# Altium schematic sheet PIC.SchDoc: Rainbow Clock Project
size A4; DrawnBy: vchesnea; Organization: In alphabetical order:; Address2: - schiad; Address3: - vchesnea; Revision: A
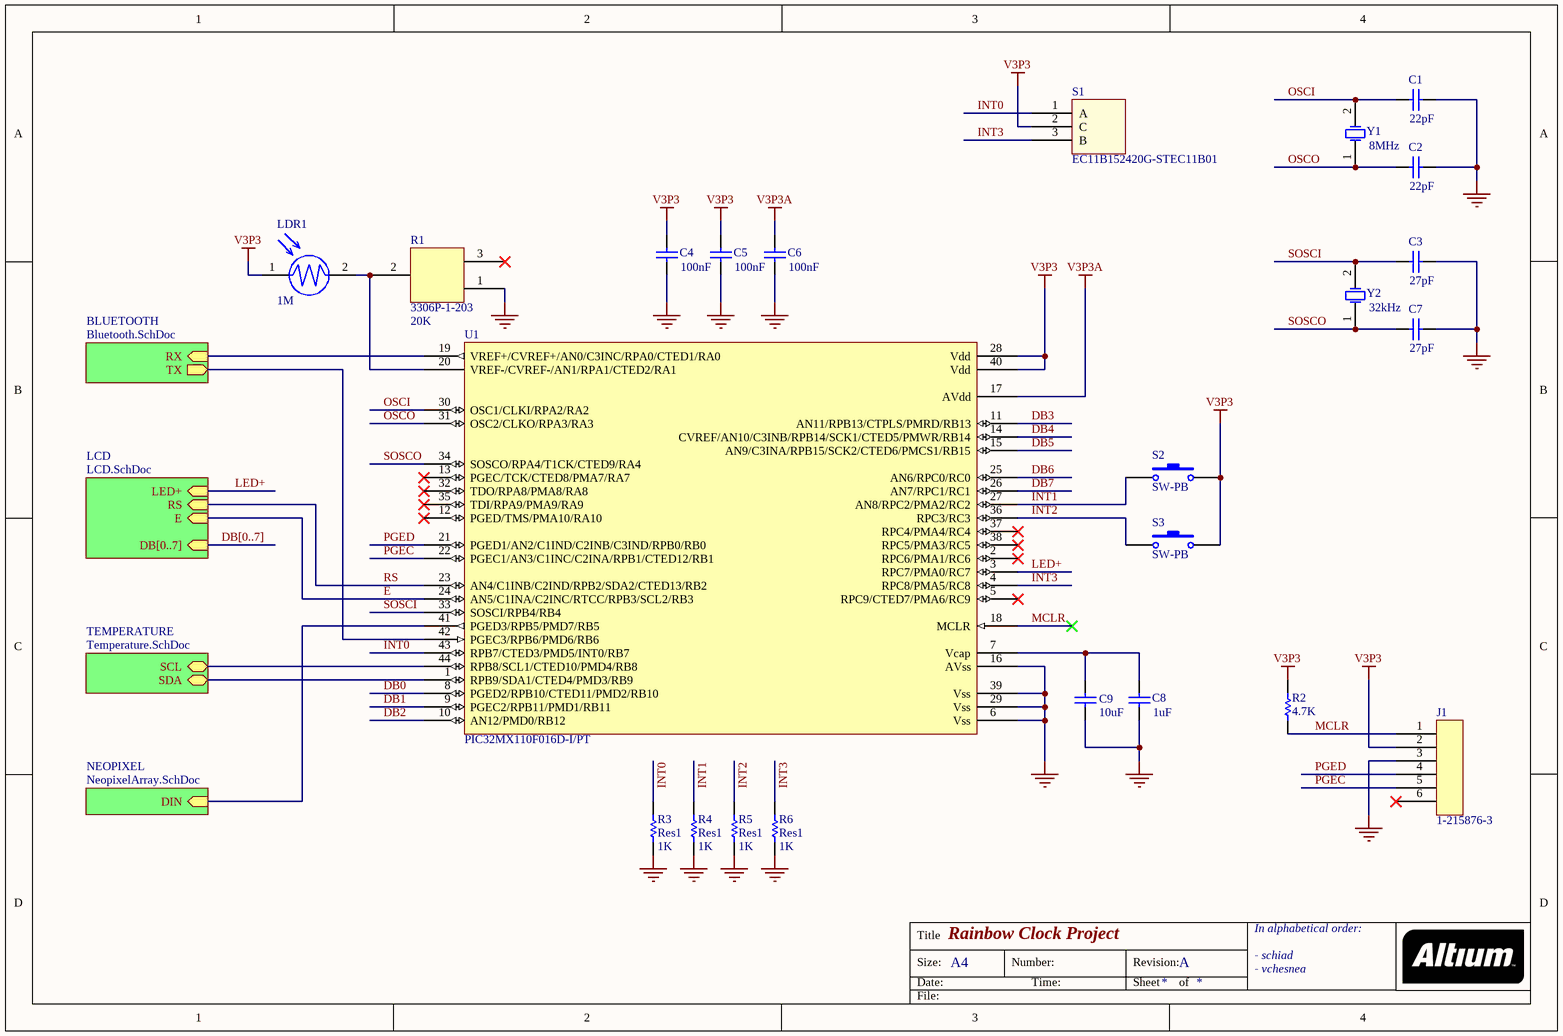
[diagram p0: PIC.SchDoc]

## Parts
C1  value 22pF  [RAD-0.3]  (hidden comment: Cap)
C2  value 22pF  [RAD-0.3]  (hidden comment: Cap)
C3  value 27pF  [RAD-0.3]  (hidden comment: Cap)
C4  value 100nF  [RAD-0.3]  (hidden comment: Cap)
C5  value 100nF  [RAD-0.3]  (hidden comment: Cap)
C6  value 100nF  [RAD-0.3]  (hidden comment: Cap)
C7  value 27pF  [RAD-0.3]  (hidden comment: Cap)
C8  value 1uF  [RAD-0.3]  (hidden comment: Cap)
C9  value 10uF  [RAD-0.3]  (hidden comment: Cap)
J1  1-215876-3
LDR1  value 1M  (hidden comment: LDR)
R1  3306P-1-203  value 20K  [3306P-1-202]
R2  value 4.7K  [AXIAL-0.3]  (hidden comment: Res1)
R3  Res1  value 1K  [AXIAL-0.3]
R4  Res1  value 1K  [AXIAL-0.3]
R5  Res1  value 1K  [AXIAL-0.3]
R6  Res1  value 1K  [AXIAL-0.3]
S1  EC11B152420G-STEC11B01  [EC11B152420G-STEC11B01]
S2  SW-PB  [Button]
S3  SW-PB  [SPST-2]
U1  PIC32MX110F016D-I/PT
Y1  value 8MHz  [R38]  (hidden comment: XTAL)
Y2  value 32kHz  [R38]  (hidden comment: XTAL)

## Sub-sheets
BLUETOOTH = Bluetooth.SchDoc: RX (in), TX (out)
LCD = LCD.SchDoc: RS (in), E (in), LED+ (in), DB[0..7] (in)
NEOPIXEL = NeopixelArray.SchDoc: DIN (in)
TEMPERATURE = Temperature.SchDoc: SDA (bidir), SCL (bidir)

## Nets
GND: C1.2 C2.2 C3.2 C4.1 C5.1 C6.1 C7.2 J1.3 R1.1 R3.2 R4.1 R5.1 R6.1
V3P3: C4.2 C5.2 J1.2 LDR1.1 R2.2 S1.2(C) S2.2 S3.2 U1.28(Vdd) U1.40(Vdd)
V3P3A: C6.2 U1.17(AVdd)
VSS: C8.1 C9.1 U1.6(Vss) U1.16(AVss) U1.29(Vss) U1.39(Vss)
DB0: U1.8(PGED2/RPB10/CTED11/PMD2/RB10)
DB1: U1.9(PGEC2/RPB11/PMD1/RB11)
DB2: U1.10(AN12/PMD0/RB12)
DB3: U1.11(AN11/RPB13/CTPLS/PMRD/RB13)
DB4: U1.14(CVREF/AN10/C3INB/RPB14/SCK1/CTED5/PMWR/RB14)
DB5: U1.15(AN9/C3INA/RPB15/SCK2/CTED6/PMCS1/RB15)
DB6: U1.25(AN6/RPC0/RC0)
DB7: U1.26(AN7/RPC1/RC1)
E: U1.24(AN5/C1INA/C2INC/RTCC/RPB3/SCL2/RB3) ; sheet LCD/E
INT0: R3.1 S1.1(A) U1.43(RPB7/CTED3/PMD5/INT0/RB7)
INT1: R4.2 S2.1 U1.27(AN8/RPC2/PMA2/RC2)
INT2: R5.2 S3.1 U1.36(RPC3/RC3)
INT3: R6.2 S1.3(B) U1.4(RPC8/PMA5/RC8)
LED+: U1.3(RPC7/PMA0/RC7) ; sheet LCD/LED+
MCLR: J1.1 R2.1 U1.18(MCLR)
OSCI: C1.1 U1.30(OSC1/CLKI/RPA2/RA2) Y1.2(OSC2)
OSCO: C2.1 U1.31(OSC2/CLKO/RPA3/RA3) Y1.1(OSC1)
PGEC: J1.5 U1.22(PGEC1/AN3/C1INC/C2INA/RPB1/CTED12/RB1)
PGED: J1.4 U1.21(PGED1/AN2/C1IND/C2INB/C3IND/RPB0/RB0)
RS: U1.23(AN4/C1INB/C2IND/RPB2/SDA2/CTED13/RB2) ; sheet LCD/RS
SOSCI: C3.1 U1.33(SOSCI/RPB4/RB4) Y2.2(OSC2)
SOSCO: C7.1 U1.34(SOSCO/RPA4/T1CK/CTED9/RA4) Y2.1(OSC1)
NetC8_2: C8.2 C9.2 U1.7(Vcap)
NetLDR1_2: LDR1.2 R1.2 U1.20(VREF-/CVREF-/AN1/RPA1/CTED2/RA1)
NetU1_1: U1.1(RPB9/SDA1/CTED4/PMD3/RB9) ; sheet TEMPERATURE/SDA
NetU1_19: U1.19(VREF+/CVREF+/AN0/C3INC/RPA0/CTED1/RA0) ; sheet BLUETOOTH/RX
NetU1_41: U1.41(PGED3/RPB5/PMD7/RB5) ; sheet NEOPIXEL/DIN
NetU1_42: U1.42(PGEC3/RPB6/PMD6/RB6) ; sheet BLUETOOTH/TX
NetU1_44: U1.44(RPB8/SCL1/CTED10/PMD4/RB8) ; sheet TEMPERATURE/SCL

Not connected (* = marked no-connect by the designer): J1 6*; R1 3*; U1 2(RPC6/PMA1/RC6)* 5(RPC9/CTED7/PMA6/RC9)* 12(PGED/TMS/PMA10/RA10)* 13(PGEC/TCK/CTED8/PMA7/RA7)* 32(TDO/RPA8/PMA8/RA8)* 35(TDI/RPA9/PMA9/RA9)* 37(RPC4/PMA4/RC4)* 38(RPC5/PMA3/RC5)*

## Buses and harness runs
bus DB[0..7] = sheet LCD/DB[0..7]

## Notes on the sheet
- Title
- Size:
- Date:
- A4
- Number:
- Time:
- Revision:
- Sheet
- of
- File:

## Library data of the parts
C1-C9 = Cap: Capacitor
J1 = 1-215876-3: Tyco 1-215876-3; RefFournisseur: 1773039; Fournisseur: Farnell; RefFabricant: 1-215876-3; Fabricant: Tyco
LDR1 = LDR: Photoresistor; RefFournisseur: 1652638; RefFabricant: VT935G; Fabricant: Excelitas Tech; Fournisseur: Farnell
R1 = 3306P-1-202: Trimpot; RefFournisseur: 108240; Fabricant: Bourns; Fournisseur: Farnell; RefFabricant: 3306P-1-203
R2-R6 = Res1: Resistor
S1 = EC11B152420G-STEC11B01: Rotary encoder; RefFournisseur: 1191733; Fournisseur: Farnell; Fabricant: ALPS; RefFabricant: EC11B152420G-STEC11B01
S2 S3 = SW-PB: Switch; RefFournisseur: 2468742; RefFabricant: 1-1825027-4; Fournisseur: Farnell; Fabricant: TE Connectivity
U1 = PIC32MX110F016D-I/PT: Microcontroller; RefFournisseur: 2057068; Fabricant: Microchip; Fournisseur: Farnell; RefFabricant: PIC32MX110F016D-I/PT
Y1 = XTAL: Crystal Oscillator; Fournisseur: Farnell; Fabricant: Fox Electronics; RefFournisseur: 2057960; RefFabricant: FOXSLF/080-20
Y2 = XTAL: Crystal Oscillator; Fabricant: Fox Electronics; Fournisseur: Farnell; RefFabricant: NC38LF-327; RefFournisseur: 2064058